# EAGLE design axiom_beta_plugin_module_1xHDMI_v0.8_r1.2 (EAGLE 7.7.0)
Assembly variants: Beta
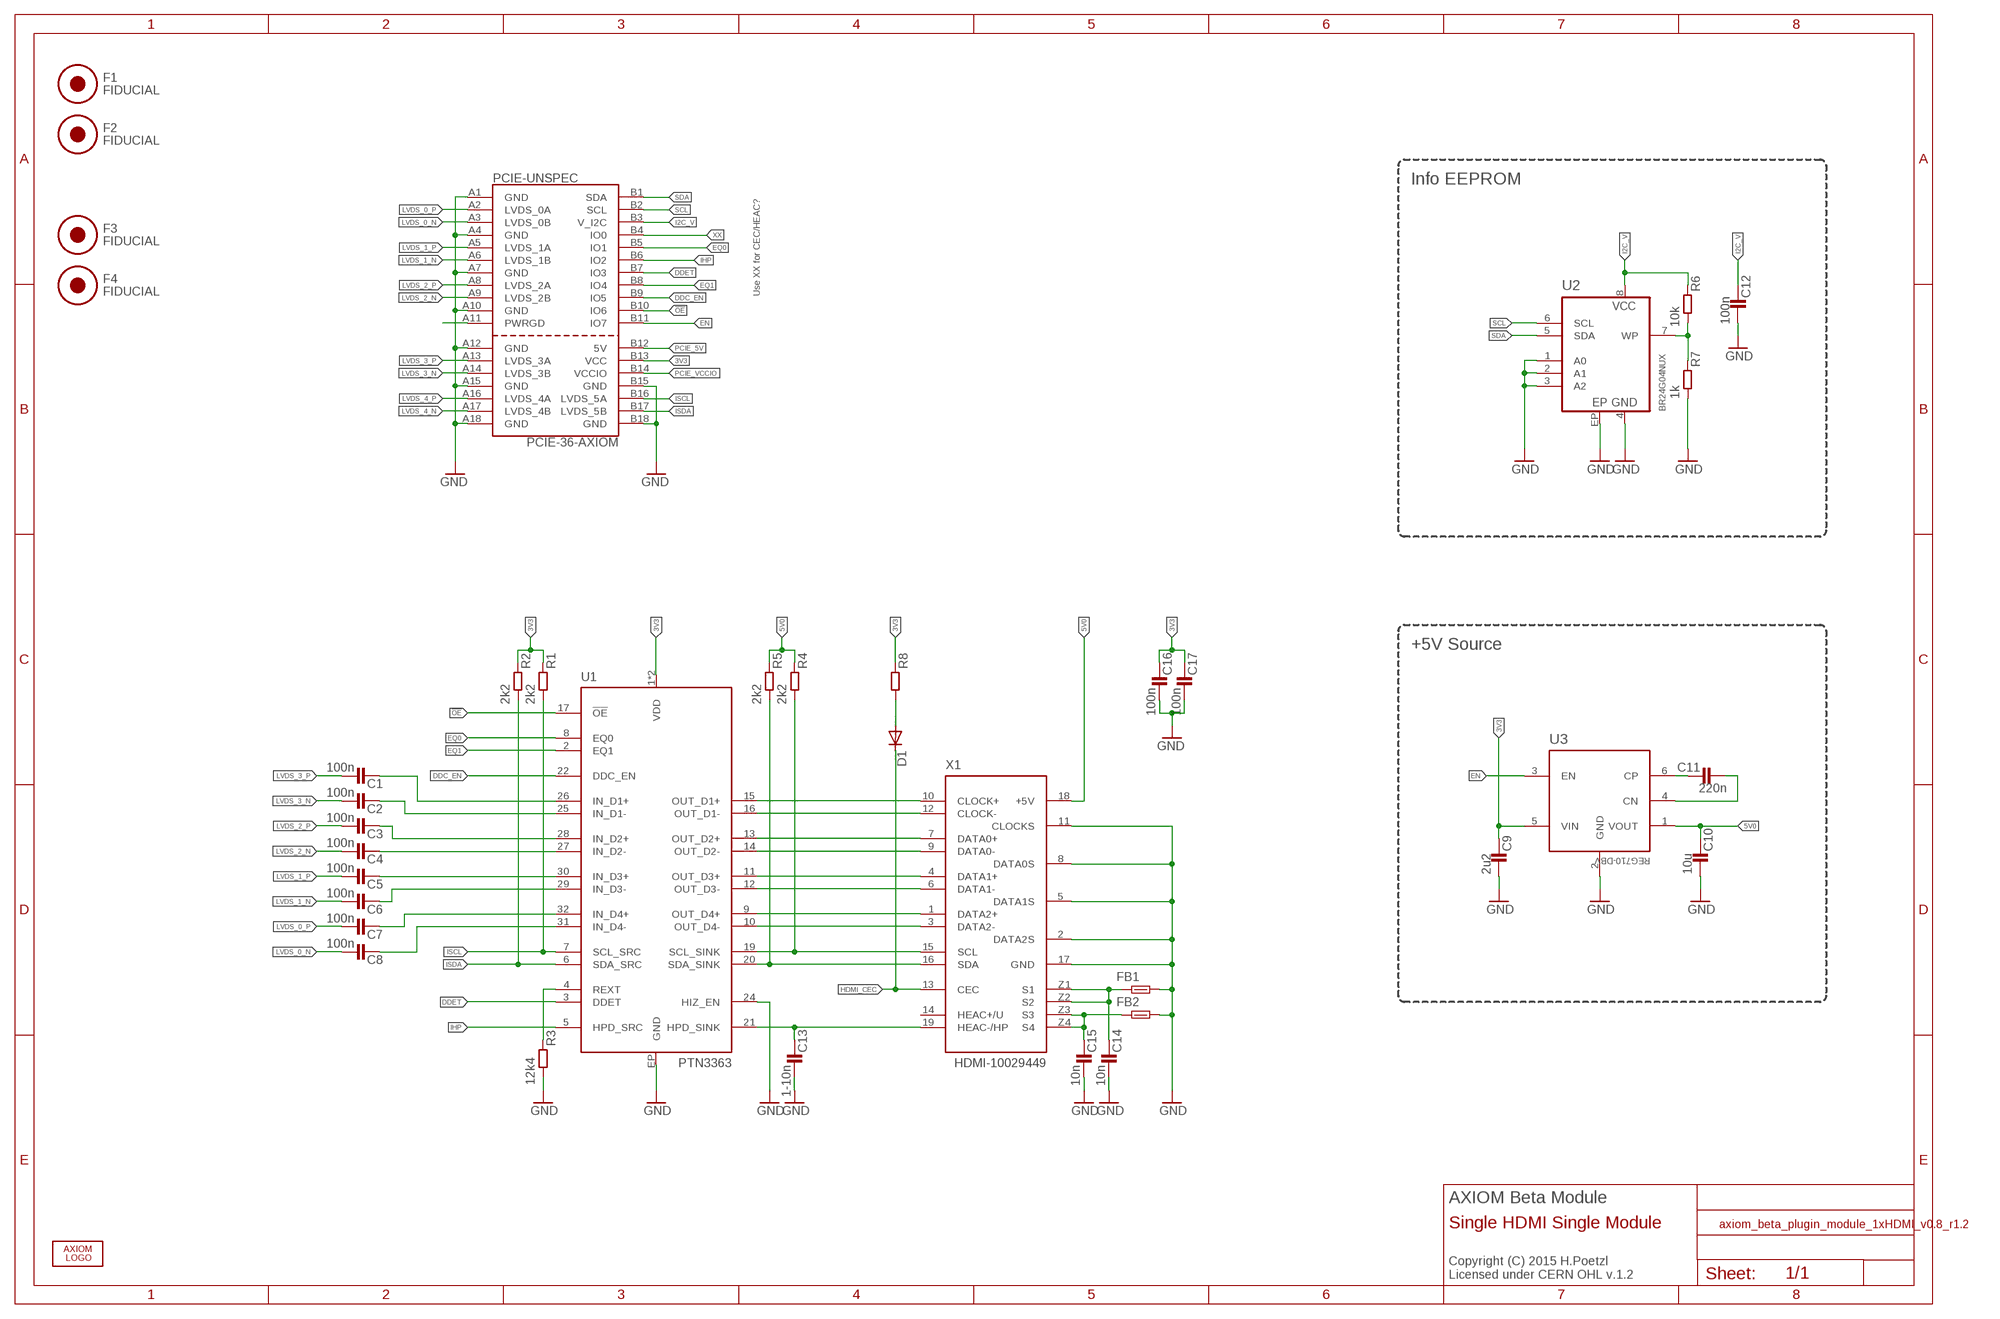
[diagram p0: schematic, sheet 1]

## Parts
C1  100n  C0402-C  [0402-C]
C2  100n  C0402-C  [0402-C]
C3  100n  C0402-C  [0402-C]
C4  100n  C0402-C  [0402-C]
C5  100n  C0402-C  [0402-C]
C6  100n  C0402-C  [0402-C]
C7  100n  C0402-C  [0402-C]
C8  100n  C0402-C  [0402-C]
C9  2u2  C0603-B  [0603-B]
C10  10u  C0603-B  [0603-B]
C11  220n  C0603-B  [0603-B]
C12  100n  C0402-B  [0402-B]
C13  1-10n  C0402-B  [0402-B]
C14  10n  C0402-B  [0402-B]
C15  10n  C0402-B  [0402-B]
C16  100n  C0402-B  [0402-B]
C17  100n  C0402-B  [0402-B]
D1  DIODE-SOD523  [SOD523]  (not fitted in variant Beta)
F1  FIDUCIAL  [FID_ARROW]
F2  FIDUCIAL  [FID_ARROW]
F3  FIDUCIAL  [FID_ARROW]
F4  FIDUCIAL  [FID_ARROW]
FB1  FB0603-B  [0603-B]
FB2  FB0603-B  [0603-B]
PCIE-UNSPEC  PCIE-36-AXIOM  [PCIE-36-AXIOM]  (not fitted in variant Beta)
R1  2k2  R0402-B  [0402-B]
R2  2k2  R0402-B  [0402-B]
R3  12k4  R0402-B  [0402-B]
R4  2k2  R0402-B  [0402-B]
R5  2k2  R0402-B  [0402-B]
R6  10k  R0402-B  [0402-B]
R7  1k  R0402-B  [0402-B]
R8  R0402-B  [0402-B]  (not fitted in variant Beta)
U1  PTN3363  [HVQFN32]
U2  BR24G04NUX  [DFN200X300X100-9N]
U3  REG710-DBV  [DBV]
U$1  AXIOM_LOGO459X70  [AXIOM_LOGO_459X70]
X1  HDMI-10029449  [10029449-X01XLF]

## Nets
3V3: C9.1 C16.1 C17.1 PCIE-UNSPEC.B13(VCC) R1.1 R2.1 R8.1 U1.1(VDD) U1.18(VDD) U3.5(VIN)
5V0: C10.1 R4.1 R5.1 U3.1(VOUT) X1.18(+5V)
!OE!: PCIE-UNSPEC.B10(IO6) U1.17(!OE!)
CLOCK_N [power]: U1.16(OUT_D1-) X1.12(CLOCK-)
CLOCK_P [power]: U1.15(OUT_D1+) X1.10(CLOCK+)
DATA0_N [power]: U1.14(OUT_D2-) X1.9(DATA0-)
DATA0_P [power]: U1.13(OUT_D2+) X1.7(DATA0+)
DATA1_N [power]: U1.12(OUT_D3-) X1.6(DATA1-)
DATA1_P [power]: U1.11(OUT_D3+) X1.4(DATA1+)
DATA2_N [power]: U1.10(OUT_D4-) X1.3(DATA2-)
DATA2_P [power]: U1.9(OUT_D4+) X1.1(DATA2+)
DDC_EN: PCIE-UNSPEC.B9(IO5) U1.22(DDC_EN)
DDET: PCIE-UNSPEC.B7(IO3) U1.3(DDET)
EN: PCIE-UNSPEC.B11(IO7) U3.3(EN)
EQ0: PCIE-UNSPEC.B5(IO1) U1.8(EQ0)
EQ1: PCIE-UNSPEC.B8(IO4) U1.2(EQ1)
GND: C9.2 C10.2 C12.2 C13.2 C14.2 C15.2 C16.2 C17.2 FB1.2 FB2.2 PCIE-UNSPEC.A1(GND) PCIE-UNSPEC.A4(GND) PCIE-UNSPEC.A7(GND) PCIE-UNSPEC.A10(GND) PCIE-UNSPEC.A12(GND) PCIE-UNSPEC.A15(GND) PCIE-UNSPEC.A18(GND) PCIE-UNSPEC.B15(GND) PCIE-UNSPEC.B18(GND) R3.2 R7.2 U1.24(HIZ_EN) U1.EP(GND) U2.1(A0) U2.2(A1) U2.3(A2) U2.4(GND) U2.EP U3.2(GND) X1.2(DATA2S) X1.5(DATA1S) X1.8(DATA0S) X1.11(CLOCKS) X1.17(GND)
HDMI_CEC: D1.C X1.13(CEC)
HDMI_HP: C13.1 U1.21(HPD_SINK) X1.19(HEAC-/HP)
HDMI_SCL: R4.2 U1.19(SCL_SINK) X1.15(SCL)
HDMI_SDA: R5.2 U1.20(SDA_SINK) X1.16(SDA)
I2C_V: C12.1 PCIE-UNSPEC.B3(V_I2C) R6.1 U2.8(VCC)
IHP: PCIE-UNSPEC.B6(IO2) U1.5(HPD_SRC)
IN_D1_N: C2.1 U1.25(IN_D1-)
IN_D1_P: C1.1 U1.26(IN_D1+)
IN_D2_N: C4.1 U1.27(IN_D2-)
IN_D2_P: C3.1 U1.28(IN_D2+)
IN_D3_N: C6.1 U1.29(IN_D3-)
IN_D3_P: C5.1 U1.30(IN_D3+)
IN_D4_N: C8.1 U1.31(IN_D4-)
IN_D4_P: C7.1 U1.32(IN_D4+)
ISCL: PCIE-UNSPEC.B16(LVDS_5A) R1.2 U1.7(SCL_SRC)
ISDA: PCIE-UNSPEC.B17(LVDS_5B) R2.2 U1.6(SDA_SRC)
LVDS_0_N: C8.2 PCIE-UNSPEC.A3(LVDS_0B)
LVDS_0_P: C7.2 PCIE-UNSPEC.A2(LVDS_0A)
LVDS_1_N [power]: C6.2 PCIE-UNSPEC.A6(LVDS_1B)
LVDS_1_P [power]: C5.2 PCIE-UNSPEC.A5(LVDS_1A)
LVDS_2_N [power]: C4.2 PCIE-UNSPEC.A9(LVDS_2B)
LVDS_2_P [power]: C3.2 PCIE-UNSPEC.A8(LVDS_2A)
LVDS_3_N [power]: C2.2 PCIE-UNSPEC.A14(LVDS_3B)
LVDS_3_P [power]: C1.2 PCIE-UNSPEC.A13(LVDS_3A)
LVDS_4_N [power]: PCIE-UNSPEC.A17(LVDS_4B)
LVDS_4_P [power]: PCIE-UNSPEC.A16(LVDS_4A)
N$1: C11.1 U3.6(CP)
N$5: C11.2 U3.4(CN)
N$6: C14.1 FB1.1 X1.Z1(S1) X1.Z2(S2)
N$12: R6.2 R7.1 U2.7(WP)
N$15: C15.1 FB2.1 X1.Z3(S3) X1.Z4(S4)
N$31: R3.1 U1.4(REXT)
N$45: D1.A R8.2
N$209: PCIE-UNSPEC.A11(PWRGD)
PCIE_5V: PCIE-UNSPEC.B12(5V)
PCIE_VCCIO: PCIE-UNSPEC.B14(VCCIO)
SCL: PCIE-UNSPEC.B2(SCL) U2.6(SCL)
SDA: PCIE-UNSPEC.B1(SDA) U2.5(SDA)
XX: PCIE-UNSPEC.B4(IO0)
Unconnected: X1.14(HEAC+/U)

## Notes on the sheet
- Info EEPROM
- Use XX for CEC/HEAC?
- +5V Source
- AXIOM Beta Module
- Single HDMI Single Module
- Copyright (C) 2015 H.Poetzl
  Licensed under CERN OHL v.1.2

## Library data of the parts
C1-C17 = generic-rcl:C
D1 = diode:DIODE-: DIODE
F1-F4 = fiducial:FIDUCIAL: Fiducials
FB1 FB2 = generic-rcl:FB
PCIE-UNSPEC = PCIe:PCIE-36-AXIOM
R1-R8 = generic-rcl:R
U1 = ptn3363:PTN3363
U2 = eeprom:BR24G04
U3 = reg710:REG710: Buck/Boost Charge Pump 60mA
U$1 = logos_apertus_axiom:AXIOM_LOGO
X1 = hdmi:HDMI

## Net classes
0 default: width 0.152 mm, drill 0.203 mm
1 power: width 0.152 mm, drill 0.203 mm

## Board
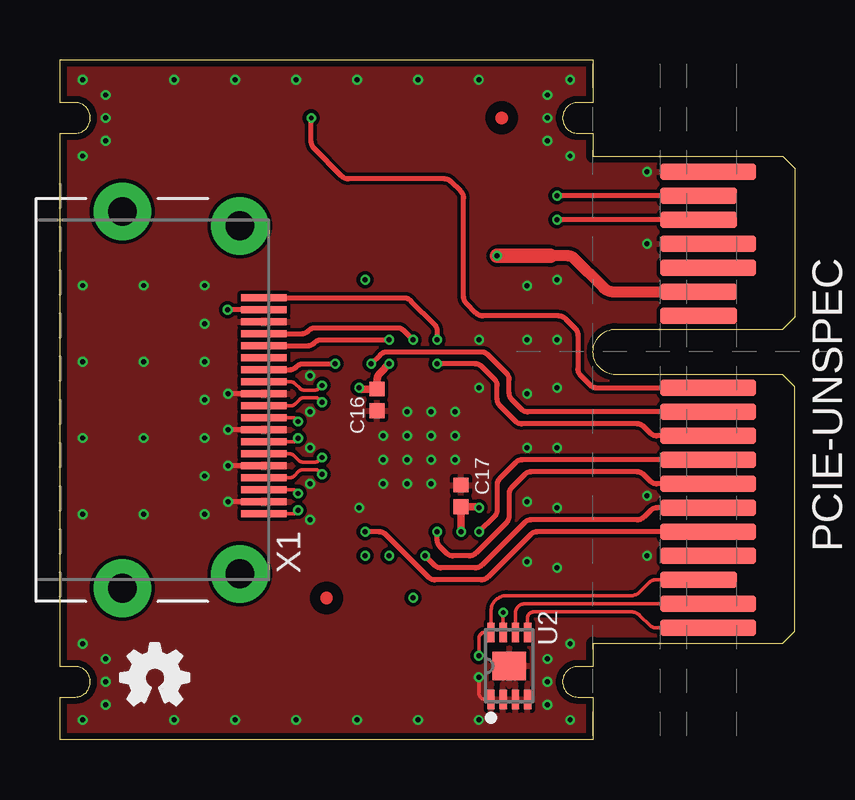
[diagram p1: board, top side]
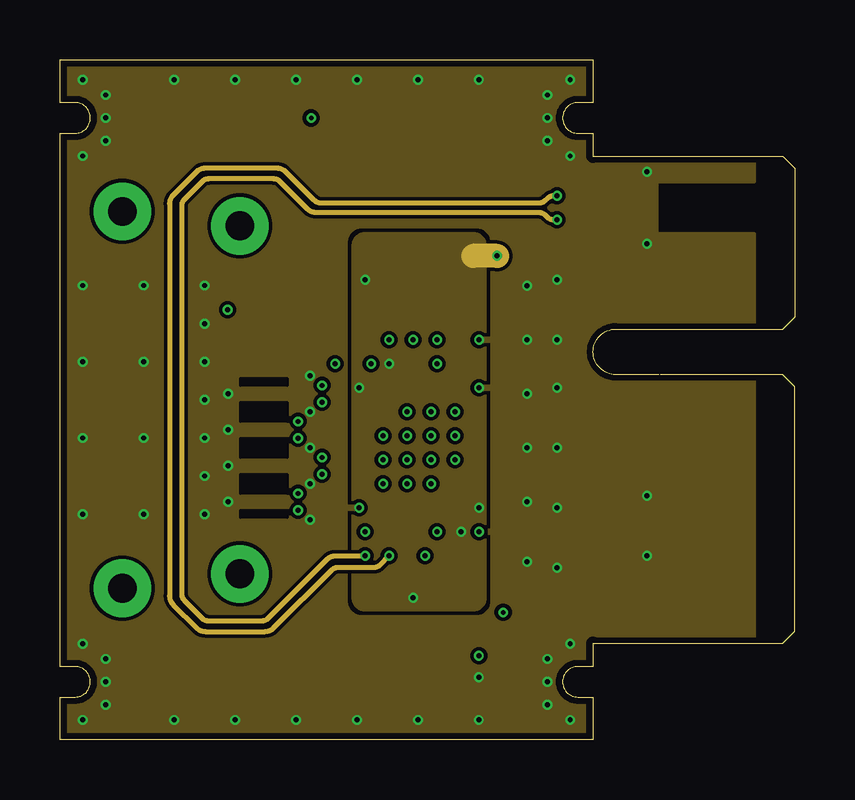
[diagram p2: board, inner layer Route2]
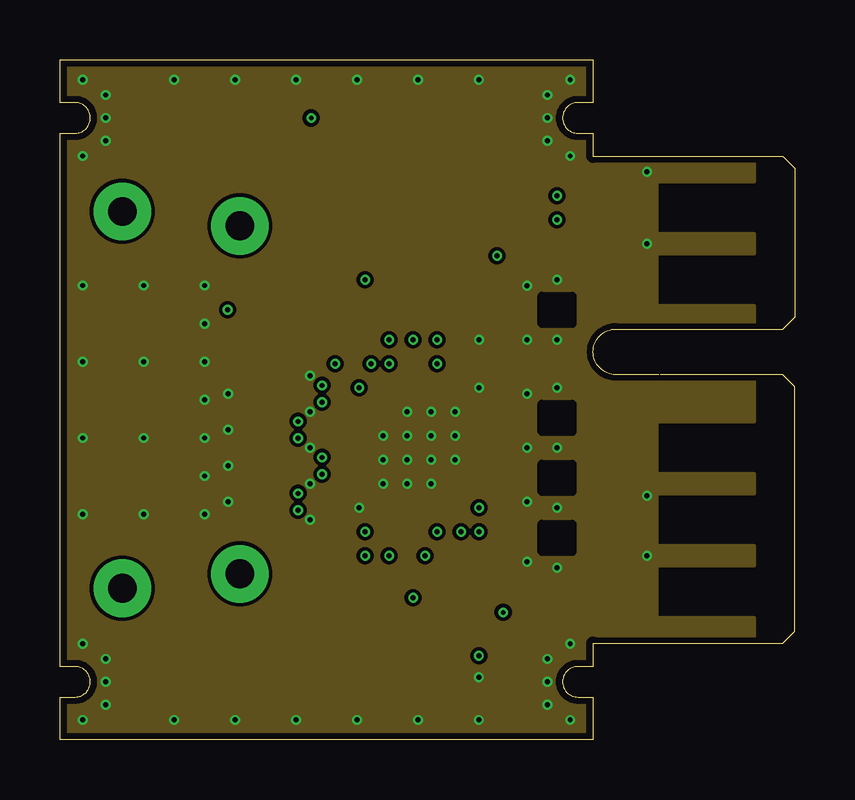
[diagram p3: board, inner layer Route15]
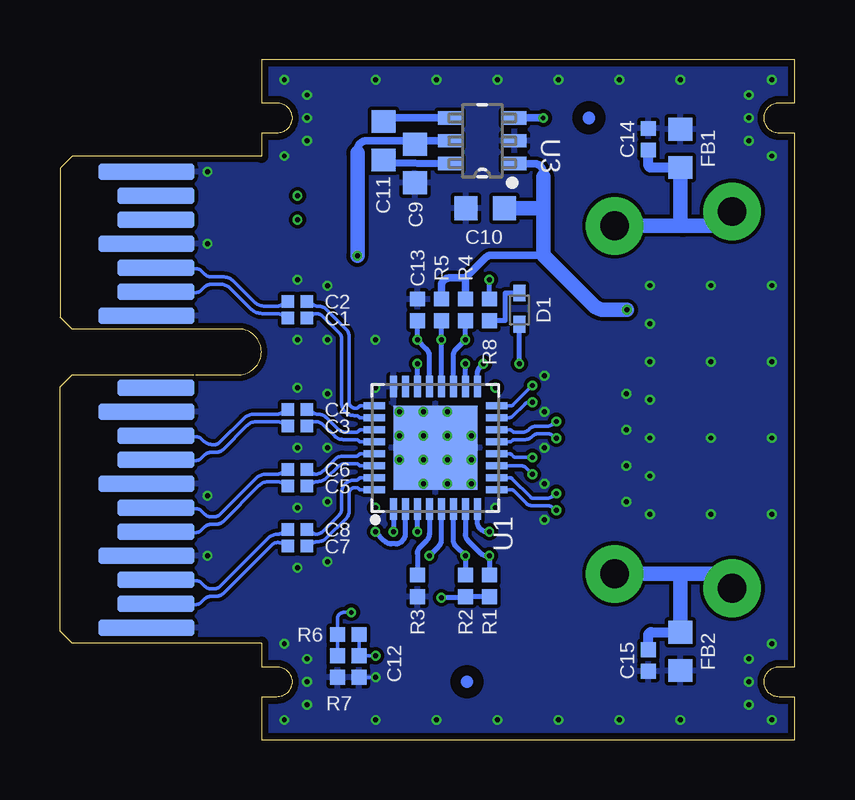
[diagram p4: board, bottom side, seen from below]

Size 30.62 x 28.32 mm. Coordinates in mm from the lower left corner, seen from the top.
Outline: 22.23,24.31 22.23,25.27 21.59,25.27 arc-90 20.96,25.91 arc-90 21.59,26.54 22.23,26.54 22.23,28.32 0,28.32 0,26.54 0.64,26.54 arc-90 1.27,25.91 arc-90 0.64,25.27 0,25.27 0,3.05 0.64,3.05 arc-90 1.27,2.41 arc-90 0.64,1.78 0,1.78 0,0 22.23,0 22.23,1.78 21.59,1.78 arc-90 20.96,2.41 arc-90 21.59,3.05 22.23,3.05 22.23,4.01
Copper layers (1*2*15*16): Top 0.035559375mm / dielectric 0.17018125mm / Route2 0.01778125mm / dielectric 47mil / Route15 0.01778125mm / dielectric 0.17018125mm / Bottom 0.035559375mm
Design rules "OSHPark-4layer-tuned *": minimum track width 5mil, minimum drill 8mil, track to track 6mil, track to pad 5mil, pad to pad 5mil, via to via 5mil, smd to smd 5mil, copper to edge 10mil, drill to drill 6mil, minimum pad ring 4mil, minimum via ring 4mil, stop-mask expansion 2mil, vias tented up to drill 15mil, thermal gap 6mil
tKeepout: area -1,24.3 to 2.2,27.5; area -1,0.8 to 2.2,4; area 20,0.8 to 23.2,4; area 20,24.3 to 23.2,27.5
bKeepout: area -1,24.3 to 2.2,27.5; area -1,0.8 to 2.2,4; area 20,0.8 to 23.2,4; area 20,24.3 to 23.2,27.5

### Footprints (pad centres in the part's own frame; a part is rotated, then mirrored left to right if it is on the bottom)
0402-C = smd 0.52 x 0.52: 1 -0.4,0; 2 0.4,0
0603-B = smd 0.95 x 1: 1 -0.8,0; 2 0.8,0
0402-B = smd 0.62 x 0.62: 1 -0.45,0; 2 0.45,0
SOD523 = smd 0.7 x 0.5: A 0.7,0; C -0.6,0
PCIE-36-AXIOM = smd 0.7 x 4 bottom: A1 -11.5,3.6; A4 -8.5,3.6; A7 -5.5,3.6; A10 -2.5,3.6; A12 1.5,3.6; A15 4.5,3.6; A18 7.5,3.6 | smd 0.7 x 3.2 bottom: A2 -10.5,4; A3 -9.5,4; A5 -7.5,4; A6 -6.5,4; A8 -4.5,4; A9 -3.5,4; A11 -1.5,4; A13 2.5,4; A14 3.5,4; A16 5.5,4; A17 6.5,4 | smd 0.7 x 4: B1 -11.5,3.6; B2 -10.5,3.6; B4 -8.5,3.6; B5 -7.5,3.6; B6 -6.5,3.6; B7 -5.5,3.6; B8 -4.5,3.6; B9 -3.5,3.6; B10 -2.5,3.6; B11 -1.5,3.6; B14 3.5,3.6; B15 4.5,3.6; B18 7.5,3.6 | smd 0.7 x 3.2: B3 -9.5,4; B12 1.5,4; B13 2.5,4; B16 5.5,4; B17 6.5,4
HVQFN32 = smd 0.9 x 0.29: 1 -2.55,1.75; 2 -2.55,1.25; 3 -2.55,0.75; 4 -2.55,0.25; 5 -2.55,-0.25; 6 -2.55,-0.75; 7 -2.55,-1.25; 8 -2.55,-1.75; 17 2.55,-1.75; 18 2.55,-1.25; 19 2.55,-0.75; 20 2.55,-0.25; 21 2.55,0.25; 22 2.55,0.75; 23 2.55,1.25; 24 2.55,1.75 | smd 0.29 x 0.9: 9 -1.75,-2.55; 10 -1.25,-2.55; 11 -0.75,-2.55; 12 -0.25,-2.55; 13 0.25,-2.55; 14 0.75,-2.55; 15 1.25,-2.55; 16 1.75,-2.55; 25 1.75,2.55; 26 1.25,2.55; 27 0.75,2.55; 28 0.25,2.55; 29 -0.25,2.55; 30 -0.75,2.55; 31 -1.25,2.55; 32 -1.75,2.55 | smd 3.5 x 3.5: EP 0,0
DFN200X300X100-9N = smd 0.813 x 0.305: 1 -1.397,0.762; 2 -1.397,0.254; 3 -1.397,-0.254; 4 -1.397,-0.762; 5 1.397,-0.762; 6 1.397,-0.254; 7 1.397,0.254; 8 1.397,0.762 | smd 1.194 x 1.397: EP 0,0
DBV = smd 0.55 x 1: 1 -0.95,-1.35; 2 0,-1.35; 3 0.95,-1.35; 4 0.95,1.35; 5 0,1.35; 6 -0.95,1.35
10029449-X01XLF = smd 0.3 x 1.9: 1 4.75,8.5; 2 4.25,8.5; 3 3.75,8.5; 4 3.25,8.5; 5 2.75,8.5; 6 2.25,8.5; 7 1.75,8.5; 8 1.25,8.5; 9 0.75,8.5; 10 0.25,8.5; 11 -0.25,8.5; 12 -0.75,8.5; 13 -1.25,8.5; 14 -1.75,8.5; 15 -2.25,8.5; 16 -2.75,8.5; 17 -3.25,8.5; 18 -3.75,8.5; 19 -4.25,8.5 | drill 1.2 pad 2.4: Z1 -7.25,7.5; Z2 -7.85,2.6; Z3 7.85,2.6; Z4 7.25,7.5

### Placement (x,y rotation side)
C1  20.73,17.56 180 bottom
C2  20.73,18.26 180 bottom
C3  20.73,13.06 180 bottom
C4  20.73,13.76 180 bottom
C5  20.73,10.56 180 bottom
C6  20.73,11.26 180 bottom
C7  20.73,8.06 180 bottom
C8  20.73,8.76 180 bottom
C9  15.82,24.01 270 bottom
C10  12.9,22.15 180 bottom
C11  17.15,24.96 90 bottom
C12  18.16,3.05 270 bottom
C13  15.73,17.91 90 bottom
C14  6.1,25.02 90 bottom
C15  6.1,3.3 270 bottom
C16  13.23,14.16 270 top
C17  16.73,10.16 90 top
D1  11.48,17.91 90 bottom
F1  18.42,25.91 0 top
F2  11.11,5.91 0 top
F3  8.57,25.91 0 bottom
F4  13.65,2.41 0 bottom
FB1  4.76,24.64 90 bottom
FB2  4.76,3.68 270 bottom
LOGO2  OSHW_LOGO_FILLX0100-NT  [OSHW_FILLX100_NOTEXT]  2.54,1.46 0 top
PCIE-UNSPEC  30.62,16.16 90 top
R1  12.73,6.41 90 bottom
R2  13.73,6.41 90 bottom
R3  15.73,6.41 270 bottom
R4  13.73,17.91 270 bottom
R5  14.73,17.91 270 bottom
R6  18.61,4.38 180 bottom
R7  19.05,3.05 270 bottom
R8  12.73,17.91 270 bottom
U1  14.98,12.16 90 bottom
U2  18.73,3.08 90 top
U3  13.02,24.96 90 bottom
U$1  4.13,24.96 0 top
X1  0,14.16 270 top

### Tracks (layer width: path | path; a pad name or v marks a point on that pad's centre or on a via)
3V3  (via drill 0.2)
  Top 0.305: v17.48,9.66 17.43,9.71 C17.1 v16.73,8.66 | v12.48,14.66 12.53,14.61 C16.1 13.23,15 arc-45 13.34,15.27 v13.73,15.66
  Top 0.457: PCIE-UNSPEC.B13 23.1,18.66 arc-45 22.65,18.85 21.45,20.05 arc45 21.18,20.16 20.45,20.16
  Top 0.61: 20.45,20.16 v18.23,20.16
  Route2 0.991: v18.23,20.16 17.23,20.16
  Bottom 0.203: U1.18 v13.73,15.66 | U1.1 v16.73,8.66 | R1.1 R2.1 13.78,5.91 v14.73,5.91 | R8.1 v12.73,19.16 | C9.1 15.82,24.96
  Bottom 0.305: 18.23,24.45 18.23,24.57 arc90 17.84,24.96 15.82,24.96 U3.5
  Bottom 0.61: 18.23,24.45 v18.23,20.16
  pour Route2: 17.22,5.41 12.73,5.41 arc-90 12.23,5.92 12.23,20.58 arc-90 12.73,21.09 17.22,21.09 arc-90 17.73,20.58 17.73,5.92 arc-90
5V0  (via drill 0.2)
  Top 0.203: X1.18 v6.99,17.91
  Bottom 0.254: U3.1 11.49,24.03
  Bottom 0.305: 10.48,20.19 12.62,20.19 arc-45 12.88,20.08 13.73,19.24 | 13.73,19.24 R4.1 | R5.1 14.73,18.9 arc90 14.38,19.24 13.73,19.24 | 10.48,23.46 10.48,23.62 arc-90 10.86,24.01 U3.1
  Bottom 0.61: 10.48,23.46 10.48,22.15 | C10.1 10.48,22.15 | 10.48,22.15 10.48,20.19 8.38,18.1 arc-45 7.93,17.91 v6.99,17.91
!OE!  (via drill 0.2)
  Top 0.203: PCIE-UNSPEC.B10 19.5,13.66 arc-45 19.23,13.77 18.84,14.17 arc-45 18.73,14.44 18.73,15 arc45 18.61,15.27 17.84,16.05 arc45 17.57,16.16 13.63,16.16 arc45 13.36,16.05 v12.98,15.66
  Bottom 0.203: U1.17 13.23,15.25 arc45 13.11,15.52 v12.98,15.66
CLOCK_N  (via drill 0.2)
  Top 0.152: X1.12 9.62,14.91 arc-45 9.8,14.84 10,14.64 arc45 10.18,14.56 10.62,14.56 arc45 10.8,14.64 v10.93,14.76
  Bottom 0.152: v10.93,14.76 11.74,13.95 arc45 11.83,13.91 U1.16
CLOCK_P  (via drill 0.2)
  Top 0.152: X1.10 9.62,13.91 arc45 9.8,13.98 10,14.18 arc-45 10.18,14.26 10.62,14.26 arc-45 10.8,14.18 v10.93,14.06
  Bottom 0.152: U1.15 11.93,13.41 arc-45 11.75,13.48 11.25,13.99 arc45 11.07,14.06 v10.93,14.06
DATA0_N  (via drill 0.2)
  Top 0.152: X1.9 9.72,13.41 arc-45 9.81,13.37 v9.93,13.26
  Bottom 0.152: v9.93,13.26 10.05,13.17 arc45 10.32,13.06 10.78,13.06 arc-45 11.05,12.95 11.08,12.92 arc45 11.35,12.81 11.67,12.81 arc45 11.76,12.85 11.79,12.87 arc-45 11.88,12.91 U1.14
DATA0_P  (via drill 0.2)
  Top 0.152: X1.7 9.72,12.41 arc45 9.81,12.45 v9.93,12.56
  Bottom 0.152: v9.93,12.56 10.05,12.65 arc-45 10.32,12.76 10.65,12.76 arc-45 10.92,12.65 10.95,12.62 arc45 11.22,12.51 11.67,12.51 arc-45 11.76,12.47 11.79,12.45 arc45 11.88,12.41 U1.13
DATA1_N  (via drill 0.2)
  Top 0.152: X1.6 9.57,11.91 arc-45 9.75,11.84 9.95,11.64 arc45 10.13,11.56 10.62,11.56 arc45 10.8,11.64 v10.93,11.76
  Bottom 0.152: U1.12 11.88,11.91 arc45 11.79,11.87 11.71,11.8 arc-45 11.62,11.76 v10.93,11.76
DATA1_P  (via drill 0.2)
  Top 0.152: X1.4 9.57,10.91 arc45 9.75,10.98 9.95,11.18 arc-45 10.13,11.26 10.62,11.26 arc-45 10.8,11.18 v10.93,11.06
  Bottom 0.152: U1.11 11.38,11.41 arc45 11.2,11.34 v10.93,11.06
DATA2_N  (via drill 0.2)
  Top 0.152: X1.3 9.72,10.41 arc-45 9.81,10.37 v9.93,10.26
  Bottom 0.152: v9.93,10.26 10.05,10.17 arc45 10.32,10.06 10.91,10.06 arc45 11,10.1 11.77,10.87 arc-45 11.86,10.91 U1.10
DATA2_P  (via drill 0.2)
  Top 0.152: X1.1 9.72,9.41 arc45 9.81,9.45 v9.93,9.56
  Bottom 0.152: v9.93,9.56 10.05,9.65 arc-45 10.32,9.76 10.98,9.76 arc45 11.16,9.83 11.7,10.37 arc-45 11.79,10.41 U1.9
DDC_EN  (via drill 0.2)
  Top 0.203: PCIE-UNSPEC.B9 24.88,12.66 arc-45 24.61,12.77 24.34,13.05 arc45 24.07,13.16 19.25,13.16 arc-45 18.98,13.27 18.34,13.92 arc-45 18.23,14.19 18.23,14.75 arc45 18.11,15.02 17.59,15.55 arc45 17.32,15.66 v15.73,15.66
  Bottom 0.203: U1.22 v15.73,15.66
DDET  (via drill 0.2)
  Top 0.203: PCIE-UNSPEC.B7 24.88,10.66 arc-45 24.61,10.77 24.34,11.05 arc45 24.07,11.16 19.63,11.16 arc45 19.36,11.05 18.84,10.52 arc45 18.73,10.25 18.73,9.32 arc-45 18.61,9.05 17.34,7.77 arc-45 17.07,7.66 16.38,7.66 arc-45 16.11,7.77 15.84,8.05 arc-45 15.73,8.32 v15.73,8.66
  Bottom 0.203: v15.73,8.66 U1.3
EN  (via drill 0.2)
  Top 0.203: PCIE-UNSPEC.B11 22.38,14.66 arc-45 22.11,14.77 21.7,15.18 arc-45 21.59,15.45 21.59,16.87 arc45 21.48,17.14 21.07,17.55 arc45 20.8,17.66 17.62,17.66 arc-45 17.35,17.77 16.94,18.18 arc-45 16.83,18.45 16.83,22.58 arc45 16.72,22.84 16.3,23.26 arc45 16.04,23.37 12.02,23.37 arc-45 11.75,23.48 10.59,24.64 arc-45 10.48,24.91 v10.48,25.91
  Bottom 0.305: U3.3 v10.48,25.91
EQ0  (via drill 0.2)
  Top 0.203: PCIE-UNSPEC.B5 19.88,8.66 arc45 19.61,8.55 17.84,6.77 arc-45 17.57,6.66 15.63,6.66 arc-45 15.36,6.77 13.59,8.55 arc45 13.32,8.66 v12.73,8.66
  Bottom 0.203: v12.73,8.66 12.82,8.66 arc45 13.09,8.77 13.11,8.8 arc45 13.23,9.07 U1.8
EQ1  (via drill 0.2)
  Top 0.203: PCIE-UNSPEC.B8 19.26,11.66 arc45 18.99,11.55 18.34,10.89 arc45 18.23,10.62 18.23,9.57 arc-45 18.11,9.3 v17.48,8.66
  Bottom 0.203: U1.2 16.23,8.57 arc45 16.34,8.3 16.36,8.27 arc45 16.63,8.16 16.82,8.16 arc45 17.09,8.27 v17.48,8.66
GND  (via drill 0.2)
  Top 0.152: U2.1 17.72,1.68 arc-90 17.46,1.93 v17.46,2.6
  Top 0.203: X1.2 v7.01,9.91 | X1.5 v7.01,11.41 | X1.8 v7.01,12.91 | X1.11 v7.01,14.41
  Bottom 0.152: v17.46,2.6 C12.2
  Bottom 0.457: v15.48,11.66 U1.EP
  other vias: 0.95,27.5 21.27,27.5 21.27,0.83 0.95,0.83 4.76,27.5 17.46,27.5 4.76,0.83 0.95,4 0.95,24.32 1.91,24.96 21.27,24.32 17.46,0.83 21.27,4 7.3,27.5 9.84,27.5 12.38,27.5 0.95,12.57 0.95,15.75 0.95,18.92 0.95,9.4 1.91,26.86 20.32,24.96 20.32,26.86 1.91,1.46 1.91,3.37 20.32,3.37 20.32,1.46 9.84,0.83 12.38,0.83 7.3,0.83 14.92,0.83 20.32,25.91 1.91,25.91 1.91,2.41 20.32,2.41 10.43,13.66 10.43,12.16 10.43,10.66 10.43,15.16 10.43,9.16 19.48,14.41 19.48,12.16 19.48,9.91 20.73,12.16 20.73,14.66 20.73,9.66 20.73,7.16 20.73,16.66 20.73,19.16 19.48,16.66 19.48,7.41 19.48,18.91 17.48,14.66 12.48,9.66 15.48,12.66 14.48,11.66 14.48,12.66 3.49,18.92 3.49,15.75 3.49,12.57 3.49,9.4 6.03,15.75 6.03,18.92 6.03,12.57 6.03,9.4 16.48,13.66 13.48,10.66 13.48,11.66 15.48,13.66 16.48,12.66 14.48,10.66 16.48,11.66 15.48,10.66 14.48,13.66 13.48,12.66 6.03,14.16 6.03,10.99 6.03,17.34 24.48,10.16 24.48,7.66 24.48,23.66 24.48,20.66 17.48,16.66 14.92,27.5
  pour Bottom (isolate 0.127): 0,28.45 22.23,28.45 22.23,24.32 25.4,24.32 25.4,3.75 22.23,3.75 22.23,-0.13 0,-0.13
  pour Top (isolate 0.127): 0,28.45 22.23,28.45 22.23,24.32 25.4,24.32 25.4,3.75 22.23,3.75 22.23,-0.13 0,-0.13
  pour Route2 (isolate 0.127, rank 3): 0,28.45 22.23,28.45 22.23,24.57 28.96,24.57 28.96,23.24 24.89,23.24 24.89,21.08 28.96,21.08 28.96,3.75 22.23,3.75 22.23,-0.13 0,-0.13
  pour Route15 (isolate 0.127, rank 3): 0,28.45 22.23,28.45 22.23,24.57 28.96,24.57 28.96,23.24 24.89,23.24 24.89,21.08 28.96,21.08 28.96,20.24 24.89,20.24 24.89,18.08 28.96,18.08 28.96,13.24 24.89,13.24 24.89,11.08 28.96,11.08 28.96,10.24 24.89,10.24 24.89,8.08 28.96,8.08 28.96,7.24 24.89,7.24 24.89,5.08 28.96,5.08 28.96,3.75 22.23,3.75 22.23,-0.13 0,-0.13
  cutout Route2: 9.48,9.26 7.53,9.26 7.53,9.56 9.48,9.56
  cutout Route2: 9.48,14.76 7.53,14.76 7.53,15.06 9.48,15.06
  cutout Route2: 9.48,13.26 7.53,13.26 7.53,14.06 9.48,14.06
  cutout Route2: 9.48,11.76 7.53,11.76 7.53,12.56 9.48,12.56
  cutout Route2: 9.48,10.26 7.53,10.26 7.53,11.06 9.48,11.06
  cutout Route15: 21.48,13.98 21.48,12.84 arc-90 21.35,12.71 20.1,12.71 arc-90 19.98,12.84 19.98,13.98 arc-90 20.1,14.11 21.35,14.11 arc-90
  cutout Route15: 21.48,11.48 21.48,10.34 arc-90 21.35,10.21 20.1,10.21 arc-90 19.98,10.34 19.98,11.48 arc-90 20.1,11.61 21.35,11.61 arc-90
  cutout Route15: 21.48,8.98 21.48,7.84 arc-90 21.35,7.71 20.1,7.71 arc-90 19.98,7.84 19.98,8.98 arc-90 20.1,9.11 21.35,9.11 arc-90
  cutout Route15: 21.48,18.48 21.48,17.34 arc-90 21.35,17.21 20.1,17.21 arc-90 19.98,17.34 19.98,18.48 arc-90 20.1,18.61 21.35,18.61 arc-90
HDMI_CEC  (via drill 0.2)
  Top 0.203: X1.13 9.57,15.41 arc45 9.84,15.52 9.86,15.55 arc-45 10.13,15.66 v11.48,15.66
  Bottom 0.203: v11.48,15.66 D1.C
HDMI_HP  (via drill 0.2)
  Top 0.203: X1.19 14.35,18.41 arc-45 14.62,18.3 15.61,17.3 arc-45 15.73,17.03 v15.73,16.66
  Bottom 0.203: U1.21 15.23,16 arc-45 15.34,16.27 v15.73,16.66 C13.1
HDMI_SCL  (via drill 0.2)
  Top 0.203: X1.15 10.32,16.41 arc45 10.59,16.52 10.61,16.55 arc-45 10.88,16.66 v13.73,16.66
  Bottom 0.203: U1.19 14.23,16 arc45 14.11,16.27 v13.73,16.66 R4.2
HDMI_SDA  (via drill 0.2)
  Top 0.203: X1.16 10.07,16.91 arc45 10.34,17.02 10.36,17.05 arc-45 10.63,17.16 14.07,17.16 arc-45 14.34,17.05 v14.73,16.66
  Bottom 0.203: U1.20 v14.73,16.66 R5.2
I2C_V  (via drill 0.2)
  Top 0.152: v17.46,3.5 17.46,4.22 arc-90 17.72,4.48 U2.8 17.97,5.36 arc-90 18.61,6 23.8,6 arc45 24.16,6.15 24.56,6.55 arc-45 24.83,6.66 PCIE-UNSPEC.B3
  Bottom 0.152: v17.46,3.5 C12.1 R6.1
IHP  (via drill 0.2)
  Top 0.203: PCIE-UNSPEC.B6 24.88,9.66 arc45 24.61,9.55 24.34,9.27 arc-45 24.07,9.16 19.63,9.16 arc45 19.36,9.05 17.59,7.27 arc-45 17.32,7.16 15.88,7.16 arc-45 15.61,7.27 v15.23,7.66
  Bottom 0.203: v15.23,7.66 14.84,8.05 arc-45 14.73,8.32 U1.5
IN_D1_N
  Bottom 0.152: U1.25 18.08,13.91 arc-45 18.17,13.87 18.19,13.85 arc45 18.28,13.81 18.32,13.81 arc90 18.57,14.07 18.57,16.82 arc-45 18.68,17.09 19.55,17.95 arc-45 19.82,18.06 19.87,18.06 arc45 20.14,18.17 C2.1
IN_D1_P
  Bottom 0.152: U1.26 18.08,13.41 arc45 18.17,13.45 18.19,13.47 arc-45 18.28,13.51 18.37,13.51 arc90 18.88,14.02 18.88,16.69 arc-45 18.99,16.96 19.68,17.65 arc-45 19.95,17.76 arc-45 20.09,17.7 C1.1
IN_D2_N
  Bottom 0.152: U1.27 18.08,12.91 arc-45 18.17,12.87 18.19,12.85 arc45 18.28,12.81 18.7,12.81 arc45 19.06,12.96 19.51,13.41 arc-45 19.87,13.56 arc45 20.14,13.67 C4.1
IN_D2_P
  Bottom 0.152: U1.28 18.08,12.41 arc45 18.17,12.45 18.19,12.47 arc-45 18.28,12.51 18.83,12.51 arc45 19.19,12.66 19.64,13.11 arc-45 20,13.26 arc-45 20.05,13.24 C3.1
IN_D3_N
  Bottom 0.152: U1.29 18.08,11.91 arc-45 18.17,11.87 18.19,11.85 arc45 18.28,11.81 18.83,11.81 arc-45 19.19,11.66 19.64,11.21 arc45 20,11.06 arc45 20.05,11.08 C6.1
IN_D3_P
  Bottom 0.152: U1.30 18.08,11.41 arc45 18.17,11.45 18.19,11.47 arc-45 18.28,11.51 18.7,11.51 arc-45 19.06,11.36 19.51,10.91 arc45 19.87,10.76 arc-45 20.14,10.65 C5.1
IN_D4_N
  Bottom 0.152: U1.31 18.08,10.91 arc-45 18.17,10.87 18.19,10.85 arc45 18.28,10.81 18.37,10.81 arc-90 18.88,10.3 18.88,9.63 arc45 18.99,9.36 19.68,8.67 arc45 19.95,8.56 arc45 20.09,8.62 C8.1
IN_D4_P
  Bottom 0.152: U1.32 18.08,10.41 arc45 18.17,10.45 18.19,10.47 arc-45 18.28,10.51 18.32,10.51 arc-90 18.57,10.25 18.57,9.51 arc45 18.68,9.24 19.55,8.37 arc45 19.82,8.26 19.87,8.26 arc-45 20.14,8.15 C7.1
ISCL  (via drill 0.2)
  Top 0.203: PCIE-UNSPEC.B16 v20.73,21.66
  Route2 0.203: v12.73,7.66 11.49,7.66 arc45 11.13,7.51 8.68,5.06 arc-45 8.42,4.95 6.19,4.95 arc-45 5.92,5.06 5.19,5.79 arc-45 5.08,6.06 5.08,22.26 arc-45 5.19,22.53 5.92,23.26 arc-45 6.19,23.37 8.92,23.37 arc-45 9.18,23.26 10.33,22.11 arc45 10.69,21.96 19.97,21.96 arc-45 20.24,21.85 20.31,21.77 arc45 20.58,21.66 v20.73,21.66
  Bottom 0.203: U1.7 13.73,8.57 arc-45 13.61,8.3 13.09,7.77 arc-45 12.82,7.66 v12.73,7.66 R1.2
ISDA  (via drill 0.2)
  Top 0.203: PCIE-UNSPEC.B17 v20.73,22.66
  Route2 0.203: v13.73,7.66 13.36,7.29 arc-45 13.09,7.18 11.59,7.18 arc45 11.32,7.07 8.91,4.66 arc-45 8.55,4.51 6.05,4.51 arc-45 5.69,4.66 4.72,5.63 arc-45 4.57,5.99 4.57,22.33 arc-45 4.72,22.69 5.69,23.66 arc-45 6.05,23.81 9.05,23.81 arc-45 9.41,23.66 10.6,22.47 arc45 10.87,22.36 19.97,22.36 arc45 20.24,22.47 20.31,22.55 arc-45 20.58,22.66 v20.73,22.66
  Bottom 0.203: R2.2 v13.73,7.66 14.11,8.05 arc45 14.23,8.32 U1.6
LVDS_0_N
  Bottom 0.152: C8.2 21.35,8.64 arc45 21.53,8.56 arc-45 21.97,8.38 23.98,6.37 arc45 24.2,6.28 24.32,6.28 arc45 24.59,6.39 24.71,6.52 arc-45 24.98,6.63 PCIE-UNSPEC.A3
LVDS_0_P
  Bottom 0.152: C7.2 21.27,8.11 arc-90 21.81,8.11 23.83,6.09 arc45 24.1,5.98 24.32,5.98 arc-45 24.59,5.87 24.71,5.74 arc45 24.98,5.63 PCIE-UNSPEC.A2
LVDS_1_N
  Bottom 0.152: C6.2 21.31,11.17 arc45 21.58,11.06 22.03,11.06 arc-45 22.47,10.88 23.98,9.37 arc45 24.2,9.28 24.32,9.28 arc45 24.59,9.39 24.71,9.52 arc-45 24.98,9.63 PCIE-UNSPEC.A6
LVDS_1_P
  Bottom 0.152: C5.2 21.31,10.65 arc-45 21.58,10.76 21.9,10.76 arc-45 22.35,10.57 23.83,9.09 arc45 24.1,8.98 24.32,8.98 arc-45 24.59,8.87 24.71,8.74 arc45 24.98,8.63 PCIE-UNSPEC.A5
LVDS_2_N
  Bottom 0.152: C4.2 21.31,13.67 arc45 21.58,13.56 22.53,13.56 arc-45 22.97,13.38 23.97,12.38 arc45 24.19,12.29 arc45 24.63,12.44 24.71,12.52 arc-45 24.98,12.63 PCIE-UNSPEC.A9
LVDS_2_P
  Bottom 0.152: C3.2 21.31,13.15 arc-45 21.58,13.26 22.4,13.26 arc-45 22.85,13.07 23.83,12.09 arc45 24.1,11.98 24.32,11.98 arc-45 24.59,11.87 24.71,11.74 arc45 24.98,11.63 PCIE-UNSPEC.A8
LVDS_3_N
  Bottom 0.152: C2.2 21.31,18.17 arc45 21.58,18.06 22.08,18.06 arc45 22.53,18.25 23.38,19.1 arc-45 23.83,19.28 24.32,19.28 arc45 24.59,19.39 24.71,19.52 arc-45 24.98,19.63 PCIE-UNSPEC.A14
LVDS_3_P
  Bottom 0.152: C1.2 21.31,17.65 arc-45 21.58,17.76 22.21,17.76 arc45 22.66,17.94 23.51,18.79 arc-45 23.95,18.98 24.32,18.98 arc-45 24.59,18.87 24.71,18.74 arc45 24.98,18.63 PCIE-UNSPEC.A13
N$1
  Bottom 0.305: U3.6 17.18,24.03 C11.1
N$5
  Bottom 0.203: 17.08,25.64 17.08,25.91
  Bottom 0.305: 17.08,25.64 C11.2 | 17.08,25.91 U3.4
N$6
  Bottom 0.406: FB1.1 5.97,23.84 arc90 6.1,23.97 C14.1
  Bottom 0.61: X1.Z2 3.05,21.56 arc45 3.41,21.41 4.64,21.41 | 4.64,21.41 X1.Z1 | FB1.1 4.76,21.54 arc-90 4.64,21.41
N$12  (via drill 0.2)
  Top 0.152: U2.7 v18.48,5.3
  Bottom 0.152: R7.1 R6.2 19.05,5.05 arc90 18.8,5.3 v18.48,5.3
N$15
  Bottom 0.406: 6.03,6.91 5.08,6.91 | C15.1 6.1,4.36 arc90 5.97,4.48 FB2.1
  Bottom 0.61: X1.Z3 3.05,6.76 arc-45 3.41,6.91 4.76,6.91 | 4.76,6.91 5.08,6.91 X1.Z4 | 4.76,6.91 FB2.1 4.76,4.51
N$31
  Bottom 0.203: U1.4 15.23,8.57 arc45 15.34,8.3 15.61,8.02 arc-45 15.73,7.75 R3.1
N$45
  Bottom 0.203: R8.2 12.07,17.46 12.07,18.61 D1.A
SCL
  Top 0.152: U2.6 18.99,5.28 arc-90 19.37,5.66 PCIE-UNSPEC.B2
SDA
  Top 0.152: U2.5 19.49,5.07 arc-90 19.75,5.32 23.83,5.32 arc-45 24.19,5.17 24.59,4.77 arc45 24.86,4.66 PCIE-UNSPEC.B1

### Text on the board
Measures: X1 | U1
tDocu: HIGH SPEED IO
_tSilk: 1x HDMI Module | V0.8 / R1.2 | (C) 2017 H.Pötzl / Licensed under / CERN OHL v.1.2
tEngrave: AXIOM BETA SPM 1xHDMI / TOP SIDE V0.8 R1.2
bEngrave: AXIOM BETA SPM 1xHDMI / BOTTOM SIDE V0.8 R1.2